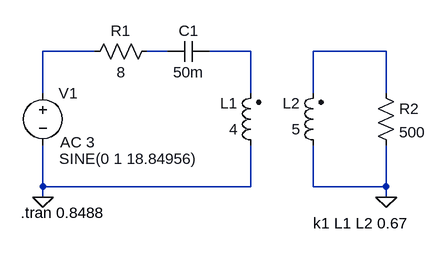
[diagram p0: schematic Task3.asc]
Task3.asc, the LTspice schematic file:
Version 4
SHEET 1 880 680
WIRE 240 64 160 64
WIRE 352 64 320 64
WIRE 480 64 416 64
WIRE 688 64 576 64
WIRE 160 128 160 64
WIRE 480 128 480 64
WIRE 576 128 576 64
WIRE 688 128 688 64
WIRE 160 272 160 208
WIRE 480 272 480 208
WIRE 480 272 160 272
WIRE 576 272 576 208
WIRE 688 272 688 208
WIRE 688 272 576 272
WIRE 160 288 160 272
WIRE 688 288 688 272
FLAG 160 288 0
FLAG 688 288 0
SYMBOL voltage 160 112 R0
WINDOW 3 25 117 Left 2
WINDOW 123 27 92 Left 2
WINDOW 39 0 0 Left 0
SYMATTR InstName V1
SYMATTR Value SINE(0 1 18.84956)
SYMATTR Value2 AC 3
SYMBOL res 336 48 R90
WINDOW 0 0 56 VBottom 2
WINDOW 3 32 56 VTop 2
SYMATTR InstName R1
SYMATTR Value 8
SYMBOL cap 416 48 R90
WINDOW 0 0 32 VBottom 2
WINDOW 3 32 32 VTop 2
SYMATTR InstName C1
SYMATTR Value 50m
SYMBOL ind2 496 224 R180
WINDOW 0 36 80 Left 2
WINDOW 3 36 40 Left 2
SYMATTR InstName L1
SYMATTR Value 4
SYMATTR Type ind
SYMBOL ind2 592 224 R180
WINDOW 0 36 80 Left 2
WINDOW 3 36 40 Left 2
SYMATTR InstName L2
SYMATTR Value 5
SYMATTR Type ind
SYMBOL res 672 112 R0
SYMATTR InstName R2
SYMATTR Value 500
TEXT 126 312 Left 2 !.tran 0.8488
TEXT 576 328 Left 2 !k1 L1 L2 0.67

The netlist it stands for:
* Task3.asc
V1 N001 0 SINE(0 1 18.84956) AC 3
R1 N002 N001 8
C1 N003 N002 50m
L1 0 N003 4
L2 0 N004 5
R2 N004 0 500
.tran 0.8488
k1 L1 L2 0.67
.backanno
.end